# Altium project AD9854.PrjPCB
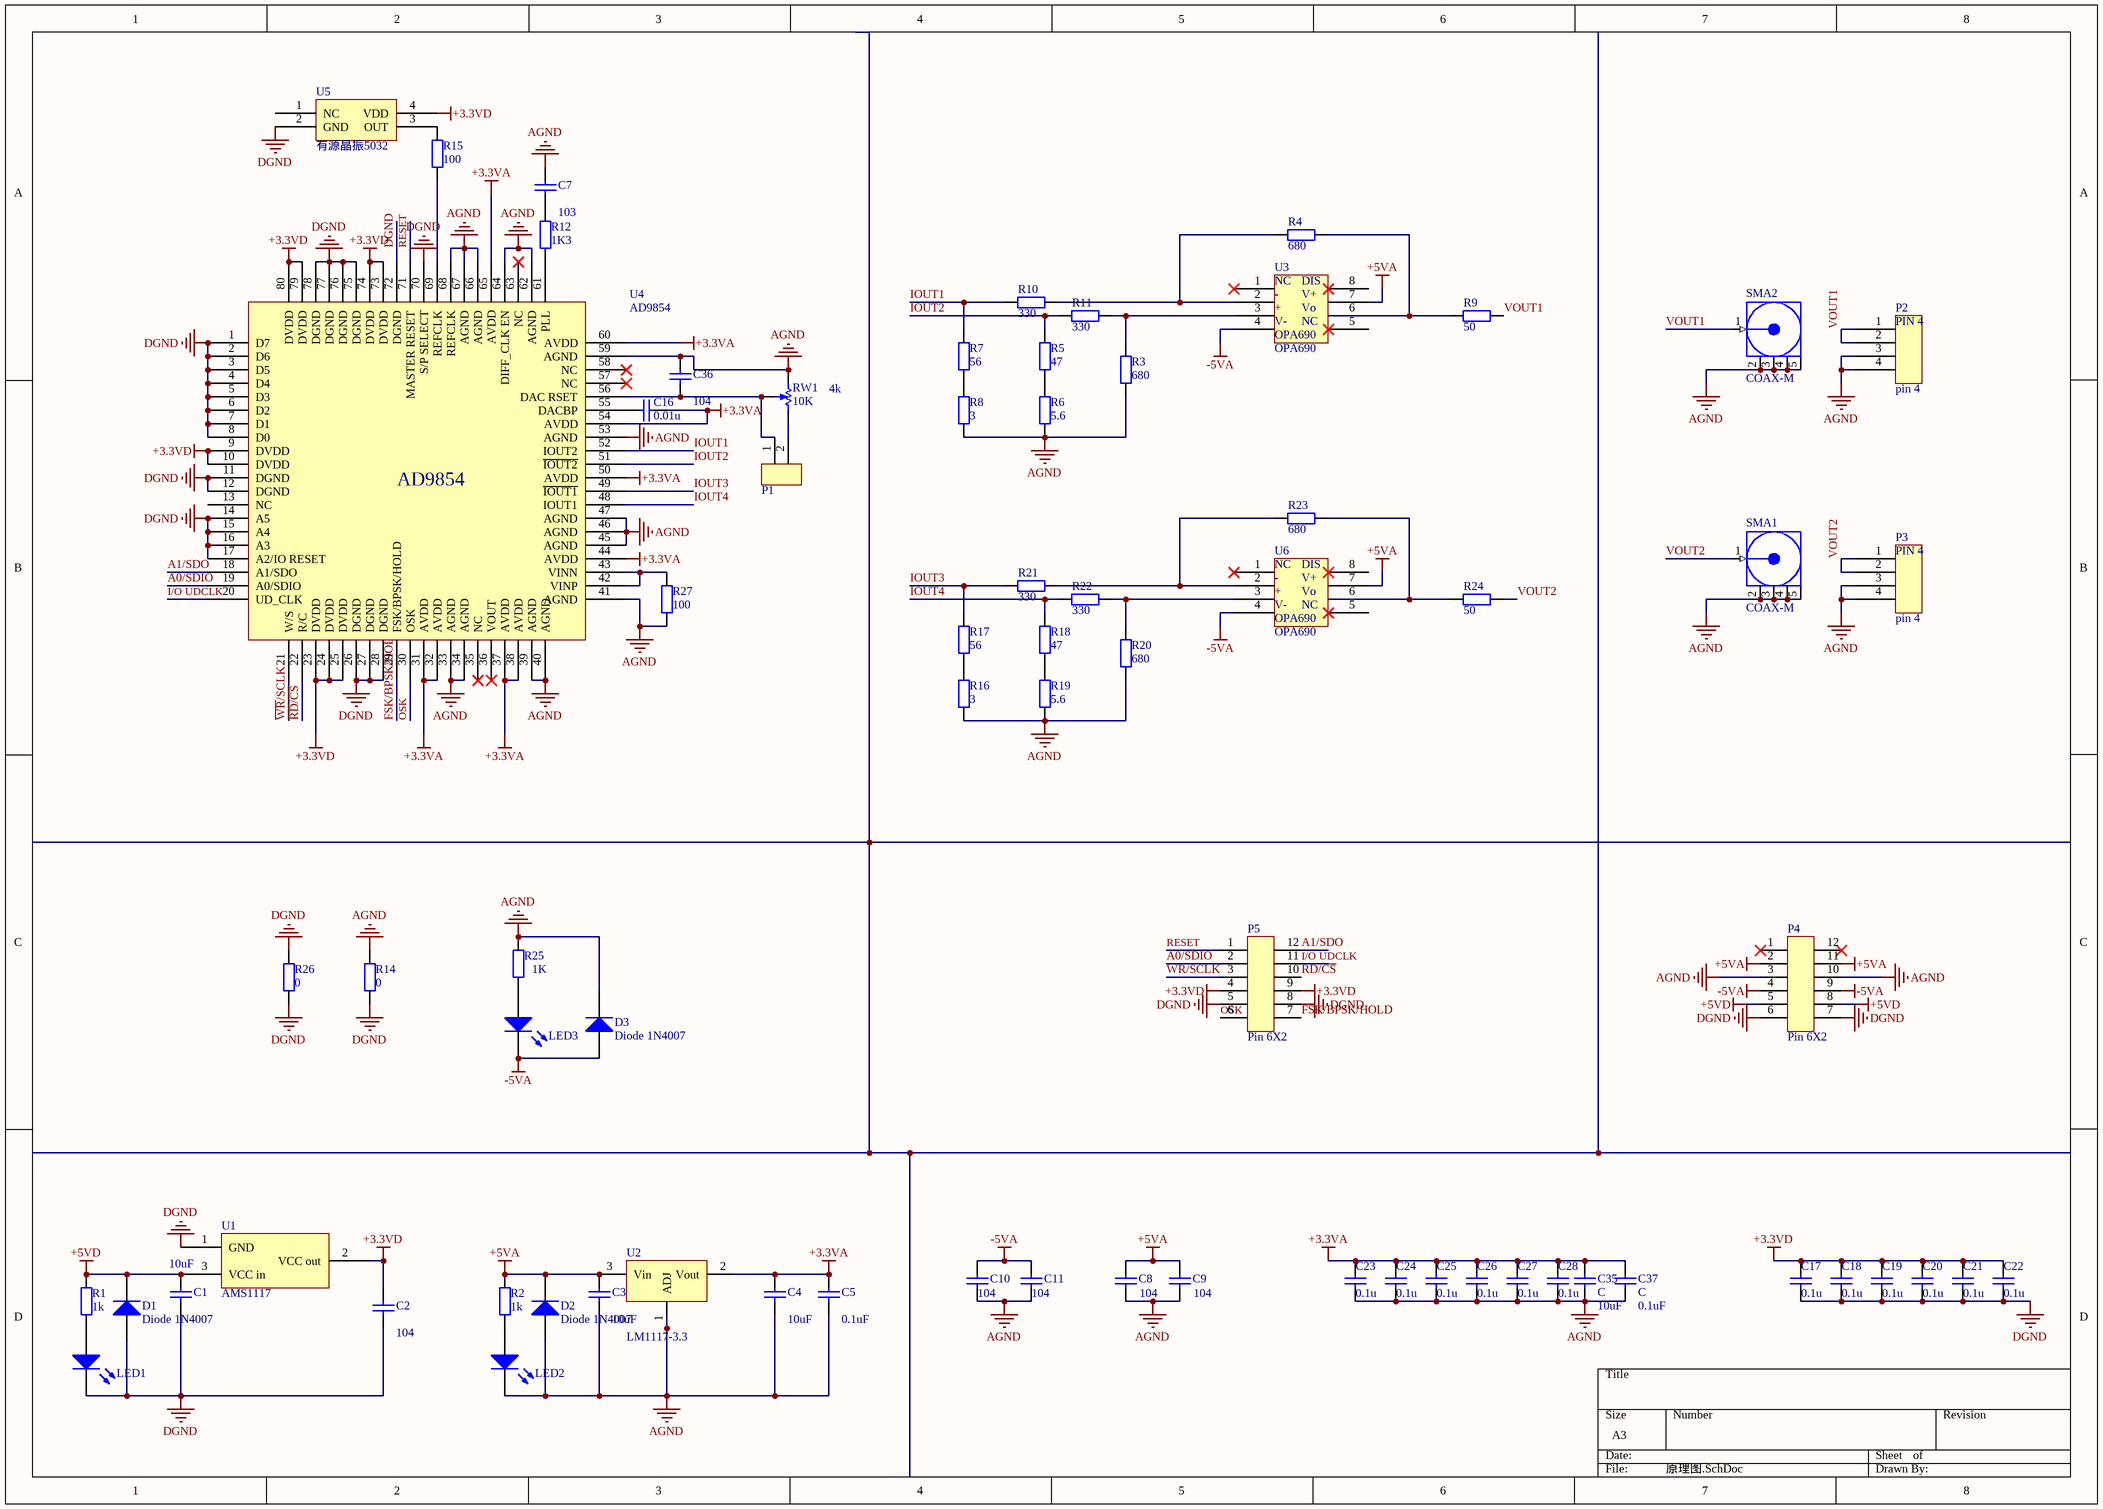
[diagram p0: 原理图.SchDoc]
1 sheet, 72 parts. Net scope: global (net labels, ports and power ports of the same name join across sheets).
Board file: PCB.PcbDoc

## Sheet 原理图.SchDoc
size A3

### Parts
C1  value 10uF  [0805]  (hidden comment: C)
C2  value 104  [0805]  (hidden comment: C)
C3  value 10uF  [0805]  (hidden comment: C)
C4  value 10uF  [0805]  (hidden comment: C)
C5  value 0.1uF  [0805]  (hidden comment: C)
C7  value 103  [0805]  (hidden comment: C)
C8  value 104  [0805]  (hidden comment: C)
C9  value 104  [0805]  (hidden comment: C)
C10  value 104  [0805]  (hidden comment: C)
C11  value 104  [0805]  (hidden comment: C)
C16  0.01u  [0805]
C17  0.1u  [0805]
C18  0.1u  [0805]
C19  0.1u  [0805]
C20  0.1u  [0805]
C21  0.1u  [0805]
C22  0.1u  [0805]
C23  0.1u  [0805]
C24  0.1u  [0805]
C25  0.1u  [0805]
C26  0.1u  [0805]
C27  0.1u  [0805]
C28  0.1u  [0805]
C35  C  value 10uF  [0805]
C36  value 104  [0805]  (hidden comment: C)
C37  C  value 0.1uF  [0805]
D1  Diode 1N4007  [二极管SMB]
D2  Diode 1N4007  [二极管SMB]
D3  Diode 1N4007  [二极管SMB]
LED1  LED  [0805]  (value not drawn)
LED2  LED  [0805]  (value not drawn)
LED3  LED  [0805]  (value not drawn)
P1  Pin 2  [Pin 2]  (value not drawn)
P2  pin 4  [pin 4]
P3  pin 4  [pin 4]
P4  Pin 6X2  [Pin 6X2]
P5  Pin 6X2  [Pin 6X2]
R1  value 1k  [0805]  (hidden comment: R)
R2  value 1k  [0805]  (hidden comment: R)
R3  value 680  [0805]  (hidden comment: R)
R4  value 680  [0805]  (hidden comment: R)
R5  value 47  [0805]  (hidden comment: R)
R6  value 5.6  [0805]  (hidden comment: R)
R7  value 56  [0805]  (hidden comment: R)
R8  value 3  [0805]  (hidden comment: R)
R9  value 50  [0805]  (hidden comment: R)
R10  value 330  [0805]  (hidden comment: R)
R11  value 330  [0805]  (hidden comment: R)
R12  1K3  [0805]
R14  0  [0805]
R15  value 100  [0805]  (hidden comment: R)
R16  value 3  [0805]  (hidden comment: R)
R17  value 56  [0805]  (hidden comment: R)
R18  value 47  [0805]  (hidden comment: R)
R19  value 5.6  [0805]  (hidden comment: R)
R20  value 680  [0805]  (hidden comment: R)
R21  value 330  [0805]  (hidden comment: R)
R22  value 330  [0805]  (hidden comment: R)
R23  value 680  [0805]  (hidden comment: R)
R24  value 50  [0805]  (hidden comment: R)
R25  value 1K  [0805]  (hidden comment: R)
R26  0  [0805]
R27  value 100  [0805]  (hidden comment: R)
RW1  value 10K  [电位器]  (hidden comment: R)
SMA1  COAX-M  [SMB_V-RJ45]
SMA2  COAX-M  [SMB_V-RJ45]
U1  AMS1117  [AMS1117]
U2  LM1117-3.3  [LM78**]
U3  OPA690  [SOP-8]
U4  AD9854  [LPQF 80 9854]
U5  有源晶振5032  [7050晶振]
U6  OPA690  [SOP-8]

### Nets
+3.3VA: C4.2 C5.2 C16.1 C23.2 C24.2 C25.2 C26.2 C27.2 C28.2 C35.2 C37.2 U2.2(Vout) U4.31(AVDD) U4.32(AVDD) U4.37(AVDD) U4.38(AVDD) U4.44(AVDD) U4.50(AVDD) U4.54(AVDD) U4.60(AVDD) U4.65(AVDD)
+3.3VD: C2.2 C17.2 C18.2 C19.2 C20.2 C21.2 C22.2 P5.4 P5.9 U1.2(VCC_out) U4.9(DVDD) U4.10(DVDD) U4.23(DVDD) U4.24(DVDD) U4.25(DVDD) U4.73(DVDD) U4.74(DVDD) U4.79(DVDD) U4.80(DVDD) U5.4(VDD)
+5VA: C3.2 C8.2 C9.2 D2.2(K) P4.2 P4.11 R2.2 U2.3(Vin) U3.7 U6.7
+5VD: C1.1 D1.2(K) P4.5 P4.8 R1.2 U1.3(VCC_in)
-5VA: C10.2 C11.2 D3.1(A) LED3.2(K) P4.4 P4.9 U3.4 U6.4
AGND: C3.1 C4.1 C5.1 C7.2 C8.1 C9.1 C10.1 C11.1 C23.1 C24.1 C25.1 C26.1 C27.1 C28.1 C35.1 C36.2 C37.1 D2.1(A) D3.2(K) LED2.2(K) P2.3 P2.4 P3.3 P3.4 P4.3 P4.10 R3.1 R6.1 R8.1 R14.2 R16.1 R19.1 R20.1 R25.2 R27.2 RW1.3(-) SMA1.2(GND) SMA1.3(GND) SMA1.4(GND) SMA1.5(GND) SMA2.2(GND) SMA2.3(GND) SMA2.4(GND) SMA2.5(GND) U2.1(ADJ) U4.33(AGND) U4.34(AGND) U4.39(AGND) U4.40(AGND) U4.41(AGND) U4.45(AGND) U4.46(AGND) U4.47(AGND) U4.53(AGND) U4.59(AGND) U4.62(AGND) U4.64(DIFF_CLK_EN) U4.66(AGND) U4.67(AGND) U4.68(REFCLK)
DGND: C1.2 C2.1 C17.1 C18.1 C19.1 C20.1 C21.1 C22.1 D1.1(A) LED1.2(K) P4.6 P4.7 P5.5 P5.8 R14.1 R26.1 R26.2 U1.1(GND) U4.1(D7) U4.2(D6) U4.3(D5) U4.4(D4) U4.5(D3) U4.6(D2) U4.7(D1) U4.8(D0) U4.11(DGND) U4.12(DGND) U4.14(A5) U4.15(A4) U4.16(A3) U4.17(A2/IO_RESET) U4.26(DGND) U4.27(DGND) U4.28(DGND) U4.70(S/P_SELECT) U4.72(DGND) U4.75(DGND) U4.76(DGND) U4.77(DGND) U4.78(DGND) U5.2(GND)
A0/SDIO: P5.2 U4.19(A0/SDIO)
A1/SDO: P5.12 U4.18(A1/SDO)
FSK/BPSK/HOLD: P5.7 U4.29(FSK/BPSK/HOLD)
I/O UDCLK: P5.11 U4.20(UD_CLK)
IOUT1: R7.2 R10.1 U4.52(IOUT2)
IOUT2: R5.2 R11.1 U4.51(~{IOUT2})
IOUT3: R17.2 R21.1 U4.49(~{IOUT1})
IOUT4: R18.2 R22.1 U4.48(IOUT1)
OSK: P5.6 U4.30(OSK)
~{RD}/~{CS}: P5.10 U4.22(R/C)
RESET: P5.1 U4.71(MASTER_RESET)
VOUT1: P2.1 P2.2 R9.2 SMA2.1(Signal)
VOUT2: P3.1 P3.2 R24.2 SMA1.1(Signal)
~{WR}/SCLK: P5.3 U4.21(W/S)
NetC7_1: C7.1 R12.2
NetC16_2: C16.2 U4.55(DACBP)
NetC36_1: C36.1 P1.1 RW1.2(W) U4.56(DAC_RSET)
NetLED1_1: LED1.1(A) R1.1
NetLED2_1: LED2.1(A) R2.1
NetLED3_1: LED3.1(A) R25.1
NetP1_2: P1.2 RW1.1(+)
NetR3_2: R3.2 R11.2 U3.3
NetR4_1: R4.1 R10.2 U3.2
NetR4_2: R4.2 R9.1 U3.6
NetR5_1: R5.1 R6.2
NetR7_1: R7.1 R8.2
NetR12_1: R12.1 U4.61(PLL)
NetR15_1: R15.1 U4.69(REFCLK)
NetR15_2: R15.2 U5.3(OUT)
NetR16_2: R16.2 R17.1
NetR18_1: R18.1 R19.2
NetR20_2: R20.2 R22.2 U6.3
NetR21_2: R21.2 R23.1 U6.2
NetR23_2: R23.2 R24.1 U6.6
NetR27_1: R27.1 U4.42(VINP) U4.43(VINN)

Not connected (* = marked no-connect by the designer): P4 1* 12*; U3 1* 5* 8*; U4 13(NC) 35(NC)* 36(VOUT)* 57(NC)* 58(NC)* 63(NC)*; U5 1(NC); U6 1* 5* 8*

### Notes on the sheet
- (near RW1) 4k
- (near U4) AD9854
- (in symbol OPA690) NC; DIS; -; V+; +; Vo; V-
- (in symbol pin 4) PIN 4

### Library data of the parts
C16-C28 = C_0805
D1-D3 = Diode 1N4007: 1 Amp General Purpose Rectifier; Published: 8-Jun-2000; LatestRevisionDate: 17-Jul-2002; LatestRevisionNote: Re-released for DXP Platform.; DatasheetVersion: 1998; PackageVersion: Aug-1999; PackageReference: DO-41; Publisher: Altium Limited; PackageDescription: Diode, Axial; Body 5.2 x 2.7 mm (LxDia. max), Lead Dia. 0.86 mm (max); Code_JEDEC: DO-204-AL; ComponentLink1Description: Manufacturer Link; ComponentLink1URL: http://www.fairchildsemi.com/; ComponentLink2Description: Datasheet; ComponentLink2URL: http://www.fairchildsemi.com/ds/1N%2F1N4001.pdf
R12 R14 R26 = R_0805
RW1 = 电位器
SMA1 SMA2 = COAX-M: RF Coaxial PCB Connector, MMCX; Thru-Hole, Vertical Mount Plug,  50 Ohm Impedance; PackageDocument: Rev. A, 16-Jun-1997; PCB_Layout: Complies with manufacturer's recommendation.; DrillSize: Corresponds to nominal value.; Published: 15-Jul-2004; LatestRevisionDate: 15-Jul-2004; LatestRevisionNote: Component Replaced.; DatasheetDocument: 30-May-2003; PackageReference: 908-21103; Publisher: Altium Limited; ComponentLink1Description: Manufacturer Link; ComponentLink1URL: http://www.amphenolrf.com/
U2 = LM317